# Altium schematic sheet Encoder_RJ45.SchDoc: STM32F446 CNC
size B; Author: AM; CompanyName: Expatria Technologies; DrawnBy: A.Marles; Engineer: AM; Organization: Expatria Technolgoies; DocumentNumber: 11; Revision: A1; SheetNumber: 11; SheetTotal: 14
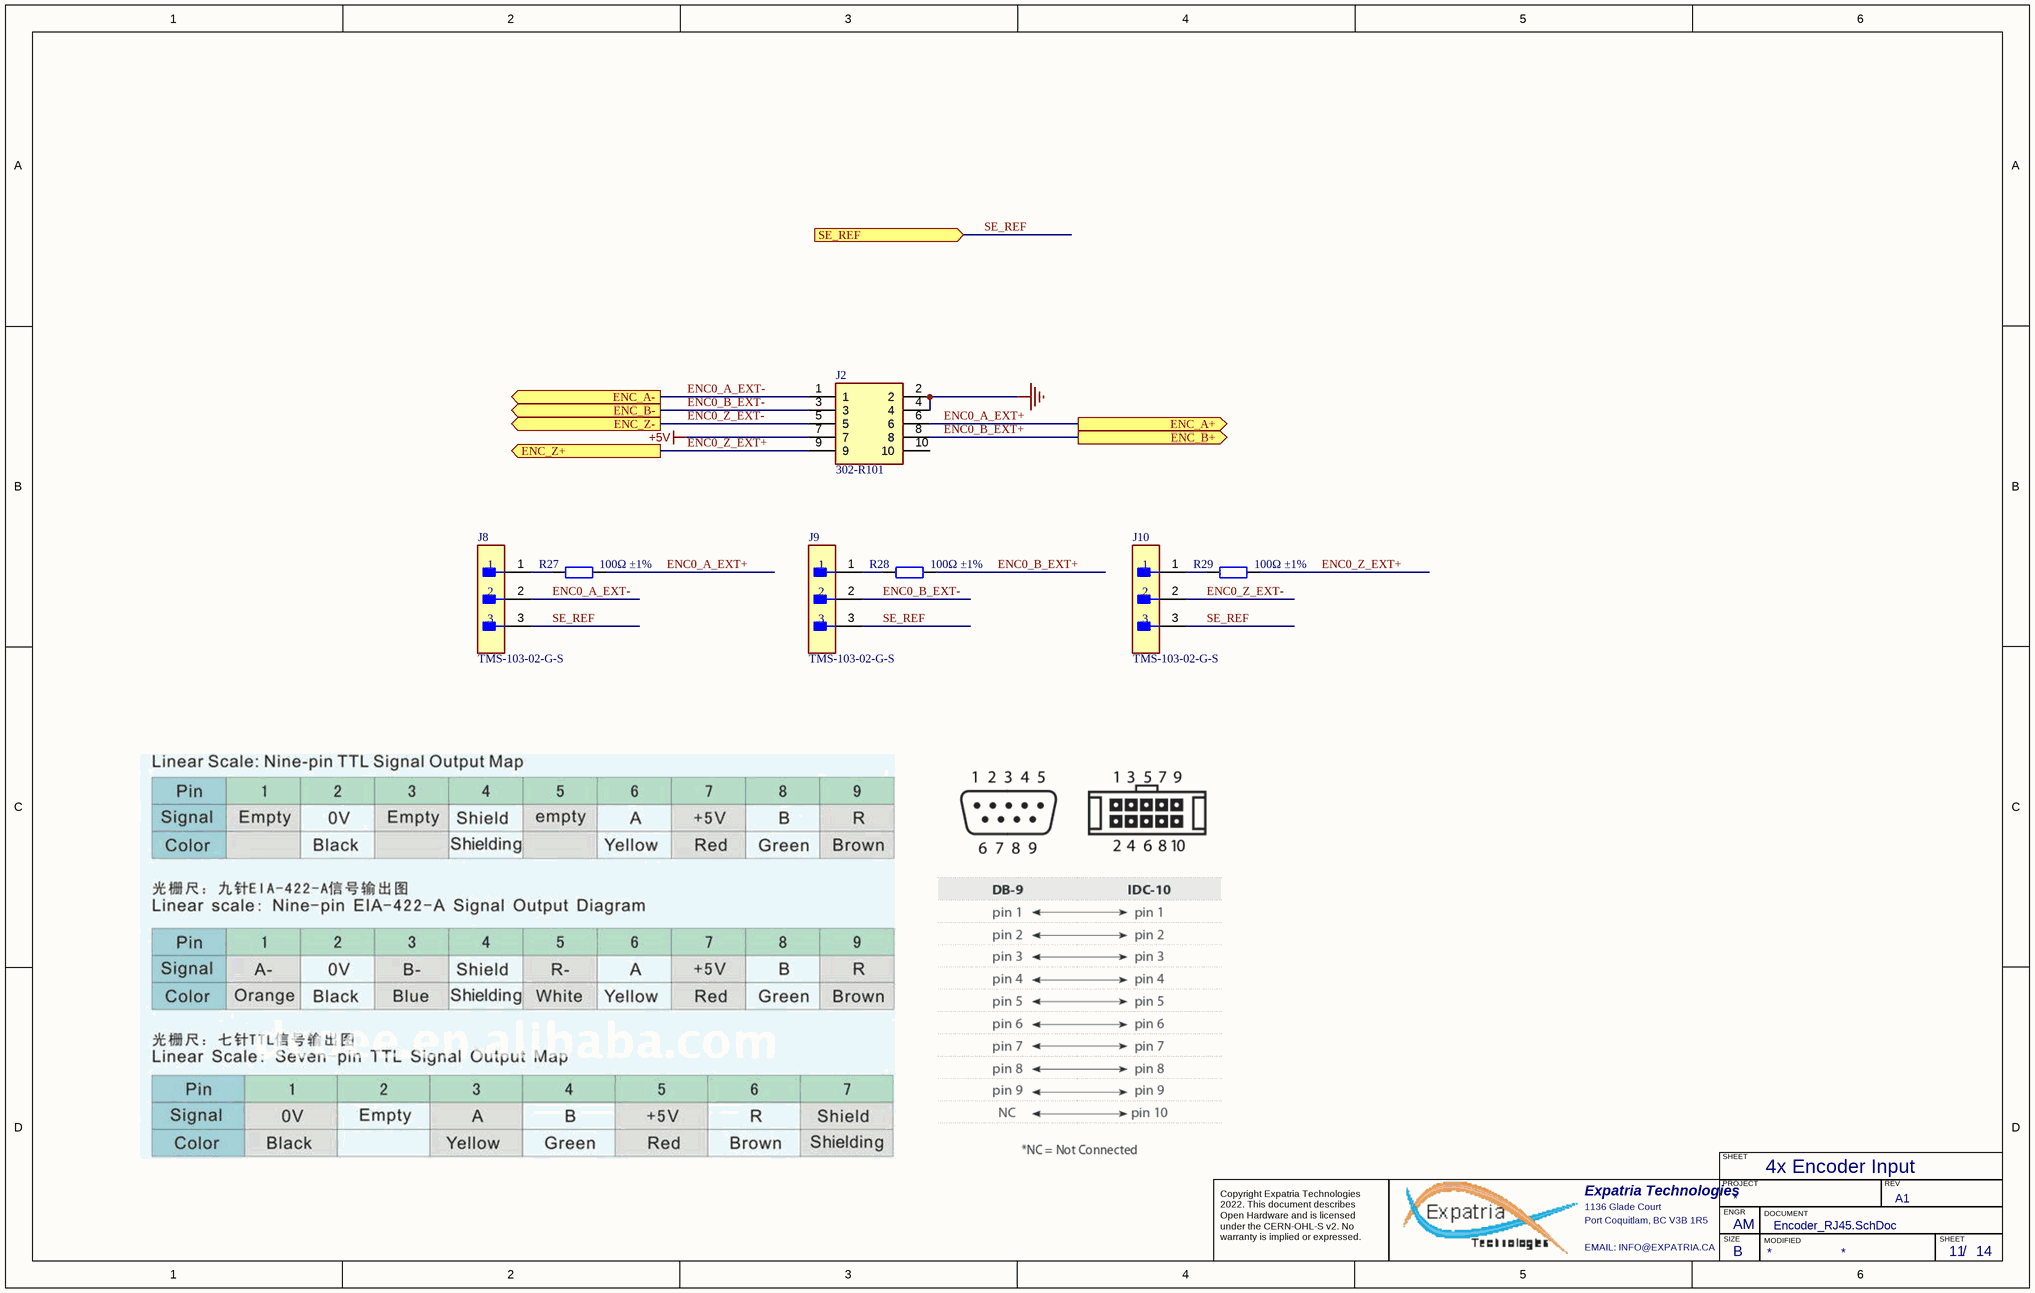
[diagram p0: Encoder_RJ45.SchDoc]

## Parts
J2  302-R101  [SHDRRA10W66P254_2X5_2032X910X910P]
J8  TMS-103-02-G-S  [FP-TMS-103-02-G-S-MFG]
J9  TMS-103-02-G-S  [FP-TMS-103-02-G-S-MFG]
J10  TMS-103-02-G-S  [FP-TMS-103-02-G-S-MFG]
R27  100Ω ±1%  [0402_R]
R28  100Ω ±1%  [0402_R]
R29  100Ω ±1%  [0402_R]

## Ports
ENC_A+ (out), ENC_A- (out), ENC_B+ (out), ENC_B- (out), ENC_Z+ (out), ENC_Z- (out), SE_REF (in)

## Nets
+5V: J2.7
GND: J2.2 J2.4
ENC0_A_EXT+: J2.6 R27.2 ; port ENC_A+
ENC0_A_EXT-: J2.1 J8.2 ; port ENC_A-
ENC0_B_EXT+: J2.8 R28.2 ; port ENC_B+
ENC0_B_EXT-: J2.3 J9.2 ; port ENC_B-
ENC0_Z_EXT+: J2.9 R29.2 ; port ENC_Z+
ENC0_Z_EXT-: J2.5 J10.2 ; port ENC_Z-
SE_REF: J8.3 J9.3 J10.3 ; port SE_REF
NetJ8_1: J8.1 R27.1
NetJ9_1: J9.1 R28.1
NetJ10_1: J10.1 R29.1

Not connected (* = marked no-connect by the designer): J2 10

## Notes on the sheet
- 4x Encoder Input
- SHEET
- Expatria Technologies
- 1136 Glade Court
- Port Coquitlam, BC V3B 1R5
- PROJECT
- SIZE
- ENGR
- MODIFIED
- DOCUMENT
- REV
- Copyright Expatria Technologies 2022. This document describes Open Hardware and is licensed under the CERN-OHL-S v2. No warranty is implied or expressed.
- EMAIL: INFO@EXPATRIA.CA
- B
- /

## Library data of the parts
J2 = 302-R101: Connector; Manufacturer_Name: On Shore Technology Inc.; Datasheet Link: http://www.on-shore.com/wp-content/uploads/2015/09/302-rxxx.pdf; Height: 9.1mm; Manufacturer_Part_Number: 302-R101; Arrow Part Number: 302-R101; Arrow Price/Stock: https://www.arrow.com/en/products/302-r101/on-shore-technology?region=nac
J8-J10 = CMP-02766-001782-1: CONN HEADER VERT 3POS 1.27MM; Number of Positions: 3; Max Current Rating: 1A; Gender: Male; Min Operating Temperature: -55°C; Housing Material: Polymer; Reach SVHC Compliant: Yes; Length: 3.81mm; Contact Material: Bronze; Series: TMS; Packaging: Bulk; Radiation Hardening: No; Insulation Material: Polymer; Contact Type: Male Pin; Orientation: Straight; Housing Color: Black; Contact Finish - Mating: GOLD; Contact Plating: Gold; Flammability Rating: UL94 V-0; Contact Shape: Square; Depth: 2.48mm; Pitch: 1.27mm; Fastening Type: Pull; RoHS Compliant: Yes; Termination: Solder; Number of Rows: 1; Insulation Color: Black; Number of Contacts: 3; Connector Type: Header; Max Operating Temperature: 125°C
R27-R29 = 0402 100R (1000) 1%: Chip resistor; Manufacturer: Uniroyal Elec; PartNumber: 0402WGF1000TCE; Power: 1/16W; ComponentLink1Description: Supplier link; ComponentLink1URL: http://www.szlcsc.com/product/details_25819.html; Package: 0402; Supplier: LC; SuppliersPartNumber: C25076; Resistance: 100Ω; Tolerance: 1%